# Altium schematic sheet Isolated Op Amp.SchDoc
size A4; SheetNumber: 8; SheetTotal: 9
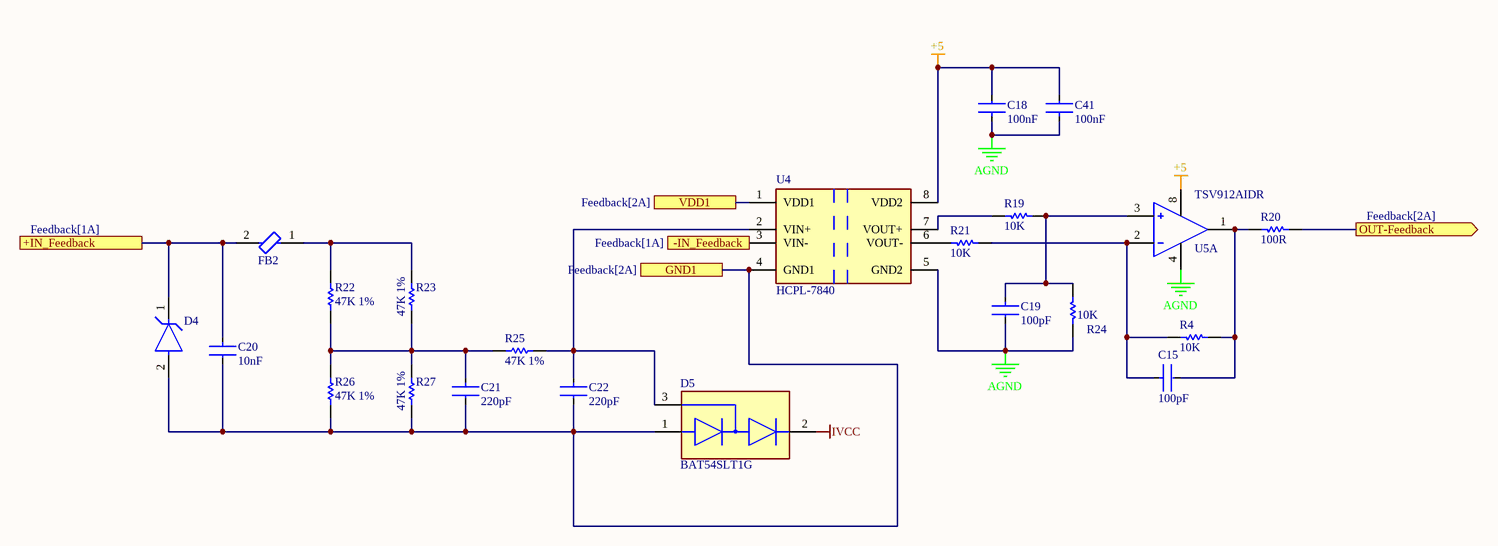
[diagram p0: Isolated Op Amp.SchDoc]

## Parts
C15  100pF  [CAP-0805]
C18  100nF  [CAP-0805]
C19  100pF  [CAP-0805]
C20  10nF  [CAP-0805]
C21  220pF  [CAP-0805]
C22  220pF  [CAP-0805]
C41  100nF  [CAP-0805]
D4  SMBJ12  [FP-SMB-MFG]  (value not drawn)
D5  BAT54SLT1G  [FP-318-08-IPC_B]
FB2  Ferrite Bead  [FP-BLM31-0_2-t1_1-MFG]  (value not drawn)
R4  10K  [RES-0805]
R19  10K  [RES-0805]
R20  100R  [RES-0805]
R21  10K  [RES-0805]
R22  47K 1%  [RES-0805]
R23  47K 1%  [RES-0805]
R24  10K  [RES-0805]
R25  47K 1%  [RES-0805]
R26  47K 1%  [RES-0805]
R27  47K 1%  [RES-0805]
U4  HCPL-7840  [FP-HCPL-7800-000E-MFG]
U5  TSV912AIDR  [FP-D0008A-MFG]  (part A of 2)

## Ports
+IN_Feedback (see Feedback[1A]), -IN_Feedback (see Feedback[1A]), GND1 (see Feedback[2A]), OUT-Feedback (out, see Feedback[2A]), VDD1 (see Feedback[2A])

## Nets
+5: C18.2 C41.2 U4.8(VDD2) U5.8(V+)
AGND: C18.1 C19.2 C41.1 R24.1 U4.5(GND2) U5.4(V-)
IVCC: D5.2(C)
+IN_Feedback: C20.1 D4.1(K) FB2.2 ; port +IN_Feedback
-IN_Feedback: U4.3(VIN-) ; port -IN_Feedback
GND1: C20.2 C21.2 C22.2 D4.2(A) D5.1(A) R26.2 R27.1 U4.4(GND1) ; port GND1
OUT-Feedback: R20.1 ; port OUT-Feedback
VDD1: U4.1(VDD1) ; port VDD1
NetC15_1: C15.1 R4.1 R21.1 U5.2(-IN_A)
NetC15_2: C15.2 R4.2 R20.2 U5.1(OUT_A)
NetC19_1: C19.1 R19.1 R24.2 U5.3(+IN_A)
NetC21_1: C21.1 R22.2 R23.1 R25.2 R26.1 R27.2
NetC22_1: C22.1 D5.3(CATHODE/ANODE) R25.1 U4.2(VIN+)
NetFB2_1: FB2.1 R22.1 R23.2
NetR19_2: R19.2 U4.7(VOUT+)
NetR21_2: R21.2 U4.6(VOUT-)

## Library data of the parts
C15 C18-C22 C41 = CAP-Ceramic: Chip Multilayer Ceramic Capacitors for General Purpose, 0603; Voltage Rating (DC): 6.3V; Dielectric: X5R; Tolerance: 20%; Packaging: Tape and Reel; Width: 0.031inch; Termination: SMD/SMT; Package Quantity: 4000; Voltage Rating: 6.3V; Case/Package: 0603; Min Operating Temperature: -55°C; Voltage: 6.3V; Length: 1.6mm; Thickness: 0.035inch; Lead Free: Lead Free; Depth: 0.8mm; Case Code (Imperial): 0603; Max Operating Temperature: 85°C; Material: Ceramic; Height: 0.8mm; Mount: Surface Mount; REACH SVHC: No SVHC; Radiation Hardening: No; Case Code (Metric): 1608
  C15 C19: Capacitance: 100pF
  C18 C41: Capacitance: 100nF
  C20: Capacitance: 10nF
  C21 C22: Capacitance: 220pF
D4 = CMP-12225-000019-1: TVS DIODE SMB; Manufacturer: STMicroelectronics; Manufacturer Part Number: SMBJ5.0A-TR; Reverse Standoff Voltage: 5V; Number Of Channels: 1; Peak Pulse Power: 600W; Clamping Voltage: 14.4V; Standoff Height: 0.05mm; Peak Pulse Current: 275A; Max Junction Temp: +150°C; Direction: Unidirectional; Breakdown Voltage: 6.4V; Device Class L3: unset; Mouser Description: SMBJ Series 600 W 5 V Uni Directional SMT TVS Diode - DO-214AA; Automotive: No; Lead Free: Yes; ComponentLink2URL: https://www.st.com/resource/en/datasheet/smbj.pdf; Package: SMB; Device Class L1: Circuit Protection; RoHS: TRUE; Temperature Range Low: -55°C; Category: Diode; Digikey Description: TVS DIODE 5V 13.4V SMB; Height: 2.65mm; Temperature Range High: +150°C; Octopart: https://octopart.com/smbj5.0a-tr-stmicroelectronics-347079; Device Class L2: TVS Diodes; ComponentLink2Description: Datasheet; Temperature: -55°C to +150°C
D5 = CMP-1055-00536-2: DIODE ARRAY SCHOTTKY 30V SOT23-3; Peak Reverse Current: 2uA; Element Configuration: Dual; Max Forward Surge Current (Ifsm): 600mA; Forward Voltage: 800mV; Recovery Time: 5ns; Peak Non-Repetitive Surge Current: 1A; Capacitance: 10pF; Power Dissipation: 225mW; Average Rectified Current: 200mA; Height: 0.94mm; Radiation Hardening: No; Width: 1.3mm; Number of Pins: 3; Max Repetitive Reverse Voltage (Vrrm): 30V; Package Quantity: 3000; Contact Plating: Tin; Case/Package: SOT-23-3; Length: 2.9mm; Max Reverse Voltage (DC): 30V; Reverse Recovery Time: 5ns; Lead Free: Lead Free; REACH SVHC: No SVHC; Max Operating Temperature: 150°C; Max Reverse Leakage Current: 2uA; Voltage Rating (DC): 30V; Max Surge Current: 600mA; Forward Current: 200mA; Packaging: Tape and Reel; Halogen Free: Halogen Free; Min Operating Temperature: -55°C; Current Rating: 200mA
FB2 = CMP-0686-00744-4: 1206; Current Rating: 1.5A; Test Frequency: 100MHz; Shielding: Unshielded; Material: Steel; Impedance: 600R; DC Resistance (DCR): 80mR; Tolerance: 25%; Number of Lines: 1; Depth: 1.6mm; Min Operating Temperature: -55°C; Military Standard: Not; Radiation Hardening: No; Number of Pins: 2; Lead Free: Lead Free; Termination: SMD/SMT; Max Operating Temperature: 125°C; Width: 1.6mm; Series: BLM31P; Max DC Current: 1.5A; Max Current Rating: 1.5A; Core Material: Ferrite; Length: 3.2mm; RoHS Compliant: Yes; Case Code (Imperial): 1206; Package Quantity: 1; Contact Plating: Tin; DC Current: 1.5A; Case/Package: 1206; Case Code (Metric): 3216; Packaging: Tape and Reel; Weight: 0.000353oz; Height: 1.1mm; DC Resistance-Max: 80mR; Frequency: 100MHz
R4 R19-R21 R24 = RES_SMD: Chip Resistor; Manufacturer: Vishay Semiconductor; Voltage Rating: 75 V; Min Operating Temperature: -55 degC; ComponentLink1URL: http://www.vishay.com/; ComponentLink1Description: Manufacturer URL; PackageReference: =Footprints; Packaging: Tape and Reel; Max Operating Temperature: 155 degC; Mount: Surface Mount; ComponentLink2Description: Datasheet; PackageDescription: 2-Pin Surface Mount Device, Body 1.575 x 0.85 mm; Length: 1.55 mm; ComponentLink2URL: http://www.vishay.com/docs/20035/dcrcwe3.pdf; Pins: 2; RoHSCompliant: true
  R4 R19 R21 R24: value: 10K
  R20: value: 100R
R22 R23 R25-R27 = RES: Resistor; Designer: Eng. Saeid Jorablo; Company: SJ Libraries; Tolerance: 5%; Power: 1/8 W; Category: Resistors; ComponentLink1Description: Datasheet; ComponentLink2Description: Reference; PackageDescription: SMD & TH Resistors; Publisher: SJ Unlimited; Mounting Technology: Surface Mount\Through-Hole; HelpURL: http://s3.picofile.com/file/7443264187/Coming_Soon_logo.gif; Status: Unreleased; Value: 47K 1%
U4 = CMP-18362-000001-1: IC OPAMP ISOLATION 1 CIRC 8DIP; Number of Circuits: 1; -3db Bandwidth: 100kHz; Output Current per Channel: 16mA; Min Supply Voltage: 4.5V; Operating Supply Current: 10.9mA; Input Offset Voltage (Vos): 300uV; Max Supply Voltage: 5.5V; Collector Emitter Breakdown Voltage: 7V; Isolation Voltage: 3.75kV; Approvals: UL; Power Supply: 5V; Input Bias Current: 500nA; Rise Time: 4.3us; Propagation Delay: 5us; Common Mode Rejection Ratio: 76dB; Packaging: Rail/Tube; Amplifier Type: ISOLATION; Package Quantity: 50; Case/Package: DIP; Min Operating Temperature: -40°C; RoHS Compliant: Yes; Series: -; Number of Pins: 8; Max Operating Temperature: 85°C; Supply Current: 16mA; Radiation Hardening: No; Voltage: 5V; Mount: Through Hole; Operating Supply Voltage: 5V; Contact Plating: Tin; Nominal Supply Current: 16mA; Number of Amplifiers: 1; Bandwidth: 100kHz; Input Current: 16mA; REACH SVHC: No SVHC; Number of Channels: 1; Lead Free: Lead Free
U5 = CMP-04895-000476-1: IC OPAMP GP 2 CIRCUIT 8SOIC; Number of Circuits: 2; Slew Rate: 4.5V/µs; Gain Bandwidth Product: 8MHz; Input Bias Current: 1pA; Operating Supply Current: 550uA; -3db Bandwidth: 80kHz; Amplifier Type: GENERAL PURPOSE; Input Offset Voltage (Vos): 300uV; Series: -; RoHS Compliant: Yes; Number of Pins: 8; Max Operating Temperature: 85°C; Mount: Surface Mount; Case/Package: SOIC; Packaging: Cut Tape; Number of Channels: 2; Min Operating Temperature: -40°C